# Altium schematic sheet Shining Pig.SchDoc
size A
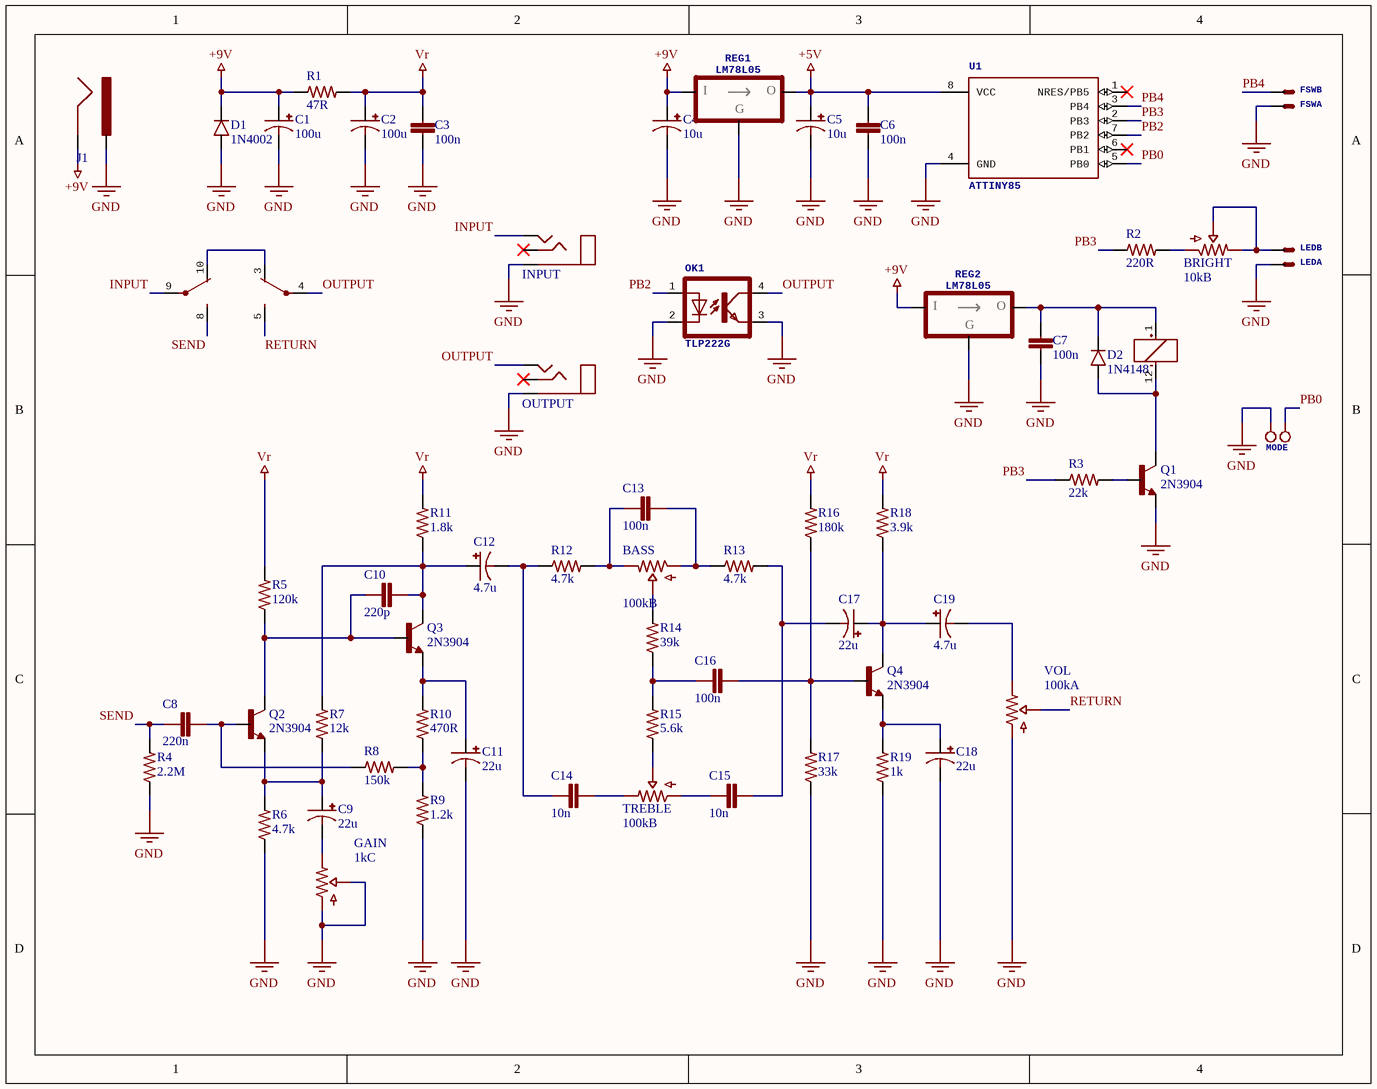
[diagram p0: Shining Pig.SchDoc]

## Parts
BASS  100kB  [ALPHA_16mm_BOTTOM]
BRIGHT  10kB  [BOURNS_3362P]
C1  100u  [ELEC_063_025]
C2  100u  [ELEC_063_025]
C3  100n  [CER_050]
C4  10u  [ELEC_040_020]
C5  10u  [ELEC_040_020]
C6  100n  [CER_050]
C7  100n  [CER_050]
C8  220n  [FILMBOX_SMALL]
C9  22u  [ELEC_LESR_050_020]
C10  220p  [CER_050]
C11  22u  [ELEC_LESR_050_020]
C12  4.7u  [ELEC_LESR_050_020]
C13  100n  [FILMBOX_SMALL]
C14  10n  [FILMBOX_SMALL]
C15  10n  [FILMBOX_SMALL]
C16  100n  [FILMBOX_SMALL]
C17  22u  [ELEC_LESR_050_020]
C18  22u  [ELEC_LESR_050_020]
C19  4.7u  [ELEC_LESR_050_020]
D1  1N4002  [DO41_2]
D2  1N4148  [DO35_2]
FSW  J_JST-XH-02  [JST-XH-02]  (value not drawn)  (parts A,B of 2)
GAIN  1kC  [ALPHA_16mm_BOTTOM]
INPUT  J_STEREO  [STEREO]  (value not drawn)
J1  J_DC_JACK  [DC_JACK]  (value not drawn)
K1  NA5W-K  [NA5]  (value not drawn)  (parts A,B,C of 3)
LED  J_JST-XH-02  [JST-XH-02]  (value not drawn)  (parts A,B of 2)
MODE  J_HEADER_2PINS  [HEADER_2PINS]  (value not drawn)
OK1  TLP222G  [DIL4]
OUTPUT  J_STEREO  [STEREO]  (value not drawn)
Q1  2N3904  [TO92]
Q2  2N3904  [TO92]
Q3  2N3904  [TO92]
Q4  2N3904  [TO92]
R1  47R  [R_3_47R_025W]
R2  220R  [R_3_220R_025W]
R3  22k  [R_3_22k_025W]
R4  2.2M  [R_3_2,2M_025W]
R5  120k  [R_3_120k_025W]
R6  4.7k  [R_3_4.7k_025W]
R7  12k  [R_3_12k_025W]
R8  150k  [R_3_150k_025W]
R9  1.2k  [R_3_1.2k_025W]
R10  470R  [R_3_470R_025W]
R11  1.8k  [R_3_1.8k_025W]
R12  4.7k  [R_3_4.7k_025W]
R13  4.7k  [R_3_4.7k_025W]
R14  39k  [R_3_39k_025W]
R15  5.6k  [R_3_5.6k_025W]
R16  180k  [R_3_180k_025W]
R17  33k  [R_3_33k_025W]
R18  3.9k  [R_3_3.9k_025W]
R19  1k  [R_3_1k_025W]
REG1  LM78L05  [TO92]
REG2  LM78L05  [TO92]
TREBLE  100kB  [ALPHA_16mm_BOTTOM]
U1  ATTINY85  [DIP8]
VOL  100kA  [ALPHA_16mm_BOTTOM]

## Nets
+5V: C5.+ C6.2 REG1.3(VO) U1.8(VCC)
+9V: C1.+ C4.+ D1.C J1.GND R1.1 REG1.1(VI) REG2.1(VI)
GND: C1.- C2.- C3.2 C4.- C5.- C6.1 C7.2 C11.- C18.- D1.A FSW.2(S) GAIN.1 GAIN.2 INPUT.S J1.PWR LED.2(S) MODE.1 OK1.2(C) OK1.3(EMIT) OUTPUT.S Q1.3(E) R4.1 R6.1 R9.1 R17.1 R19.1 REG1.2(GND) REG2.2(GND) U1.4(GND) VOL.1
Vr: C2.+ C3.1 R1.2 R5.2 R11.2 R16.2 R18.2
INPUT: INPUT.T K1.9(P)
OUTPUT: K1.4(P) OK1.4(COL) OUTPUT.T
PB0: MODE.2 U1.5(PB0)
PB2: OK1.1(A) U1.7(PB2)
PB3: R2.1 R3.1 U1.2(PB3)
PB4: FSW.1(S) U1.3(PB4)
RETURN: K1.5(S) VOL.2
SEND: C8.2 K1.8(S) R4.2
NetBASS_1: BASS.1 C13.1 R13.1
NetBASS_2: BASS.2 R14.2
NetBASS_3: BASS.3 C13.2 R12.2
NetBRIGHT_1: BRIGHT.1 R2.2
NetBRIGHT_2: BRIGHT.2 BRIGHT.3 LED.1(S)
NetC7_1: C7.1 D2.C K1.1(+) REG2.3(VO)
NetC8_1: C8.1 Q2.2(B) R8.1
NetC9_+: C9.+ Q2.3(E) R6.2 R7.1
NetC9_-: C9.- GAIN.3
NetC10_1: C10.1 C12.+ Q3.1(C) R7.2 R11.1
NetC10_2: C10.2 Q2.1(C) Q3.2(B) R5.1
NetC11_+: C11.+ Q3.3(E) R10.2
NetC12_-: C12.- C14.2 R12.1
NetC14_1: C14.1 TREBLE.3
NetC15_1: C15.1 C17.- R13.2
NetC15_2: C15.2 TREBLE.1
NetC16_1: C16.1 Q4.2(B) R16.1 R17.2
NetC16_2: C16.2 R14.1 R15.2
NetC17_+: C17.+ C19.+ Q4.1(C) R18.1
NetC18_+: C18.+ Q4.3(E) R19.2
NetC19_-: C19.- VOL.3
NetD2_A: D2.A K1.12(-) Q1.1(C)
NetK1_3: K1.3(O) K1.10(O)
NetQ1_2: Q1.2(B) R3.2
NetR8_2: R8.2 R9.2 R10.1
NetR15_1: R15.1 TREBLE.2

Not connected (* = marked no-connect by the designer): INPUT R*; OUTPUT R*; U1 1(NRES/PB5)* 6(PB1)*

## Notes on the sheet
- (in symbol REG_LM78L05) I; O; G

## Library data of the parts
BASS TREBLE = POT_100kB_ALPHA_16mm: 100k Lin potentiometer round shaft; Price: 0.5; Dimensions: 16mm; Package: PCB Mounted
BRIGHT = TRIM_10kB_3362P: 10k Lin 3362P trimmer; Price: 0.1
C1 C2 = C_ELEC_100u_25V: 100u 25V electrolytic capacitor; PinSpacing: 2.54mm; Price: 0.02; Dimensions: 6.3x8mm; Package: Radial
C3 C6 C7 = C_CER_100n: 100n MLCC X7R radial capacitor; PinSpacing: 5.08mm; Price: 0.02; Package: Radial
C4 C5 = C_ELEC_10u_50V: 10u 50V electrolytic capacitor; PinSpacing: 2mm; Price: 0.02; Dimensions: 4x8mm; Package: Radial
C8 = C_FILMBOX_220n: 220n 100V polyester film box capacitor; PinSpacing: 5.08mm; Price: 0.05; Dimensions: 7.2x2.5x6.5mm; Package: Radial
C9 C11 C17 C18 = C_ELEC_LESR_22u_50V: 22u 50V Low ESR ectrolytic capacitor; PinSpacing: 2mm; Price: 0.05; Dimensions: 5x11mm; Package: Radial
C10 = C_CER_220p: 220p MLCC X7R radial capacitor; PinSpacing: 5.08mm; Price: 0.01; Package: Radial
C12 C19 = C_ELEC_LESR_4.7u_50V: 4.7u 50V Low ESR ectrolytic capacitor; PinSpacing: 2mm; Price: 0.05; Dimensions: 5x11mm; Package: Radial
C13 C16 = C_FILMBOX_100n: 100n 100V polyester film box capacitor; PinSpacing: 5.08mm; Price: 0.05; Dimensions: 7.2x2.5x6.5mm; Package: Radial
C14 C15 = C_FILMBOX_10n: 10n 100V polyester film box capacitor; PinSpacing: 5.08mm; Price: 0.05; Dimensions: 7.2x2.5x6.5mm; Package: Radial
D1 = D_1N4002: PinSpacing: 7.62mm; Price: 0.01; Package: DO-41
D2 = D_1N4148: PinSpacing: 5.08mm; Price: 0.01; Package: DO-35
FSW LED = J_JST-XH-02: 2 Pins male XH header; Price: 0.1
GAIN = POT_1kC_ALPHA_16mm: 1k Reverse log potentiometer round shaft; Price: 0.5; Dimensions: 16mm; Package: PCB Mounted
INPUT OUTPUT = J_STEREO: 6.35mm stereo insulated socket jack PCB mounted; Price: 0.5
J1 = J_DC_JACK: DC Power jack 2.1mm barrel; Price: 0.05
K1 = K_NA5W-K: Price: 1.1
MODE = J_HEADER_2PINS: 2 Pins male header; Pin spacing: 2.54mm; Price: 0.01
OK1 = OK_TLP222G: Price: 0.36
Q1-Q4 = Q_2N3904: Price: 0.01; Package: TO-92
R1 = R_3_47R_025W: 47R metal film 1/4W Resistor; PinSpacing: 7.62mm; Price: 0.01
R2 = R_3_220R_025W: 220R metal film 1/4W Resistor; PinSpacing: 7.62mm; Price: 0.01
R3 = R_3_22k_025W: 22k metal film 1/4W Resistor; PinSpacing: 7.62mm; Price: 0.01
R4 = R_3_2.2M_025W: 2.2M metal film 1/4W Resistor; PinSpacing: 7.62mm; Price: 0.01
R5 = R_3_120k_025W: 120k metal film 1/4W Resistor; PinSpacing: 7.62mm; Price: 0.01
R6 R12 R13 = R_3_4.7k_025W: 4.7kk metal film 1/4W Resistor; PinSpacing: 7.62mm; Price: 0.01
R7 = R_3_12k_025W: 12k metal film 1/4W Resistor; PinSpacing: 7.62mm; Price: 0.01
R8 = R_3_150k_025W: 150k metal film 1/4W Resistor; PinSpacing: 7.62mm; Price: 0.01
R9 = R_3_1.2k_025W: 1.2k metal film 1/4W Resistor; PinSpacing: 7.62mm; Price: 0.01
R10 = R_3_470R_025W: 470R metal film 1/4W Resistor; PinSpacing: 7.62mm; Price: 0.01
R11 = R_3_1.8k_025W: 1.8k metal film 1/4W Resistor; PinSpacing: 7.62mm; Price: 0.01
R14 = R_3_39k_025W: 39k metal film 1/4W Resistor; PinSpacing: 7.62mm; Price: 0.01
R15 = R_3_5.6k_025W: 5.6k metal film 1/4W Resistor; PinSpacing: 7.62mm; Price: 0.01
R16 = R_3_180k_025W: 180k metal film 1/4W Resistor; PinSpacing: 7.62mm; Price: 0.01
R17 = R_3_33k_025W: 33k metal film 1/4W Resistor; PinSpacing: 7.62mm; Price: 0.01
R18 = R_3_3.9k_025W: 3.9k metal film 1/4W Resistor; PinSpacing: 7.62mm; Price: 0.01
R19 = R_3_1k_025W: 1k metal film 1/4W Resistor; PinSpacing: 7.62mm; Price: 0.01
REG1 REG2 = REG_LM78L05: 78L05; Price: 0.01; Package: TO-92
U1 = U_ATTINY85: ATTINY85-20PU; Price: 1.2; Package: DIP-8
VOL = POT_100kA_ALPHA_16mm: 100k Log potentiometer round shaft; Price: 0.5; Dimensions: 16mm; Package: PCB Mounted